# Altium project PE2.PrjPcb
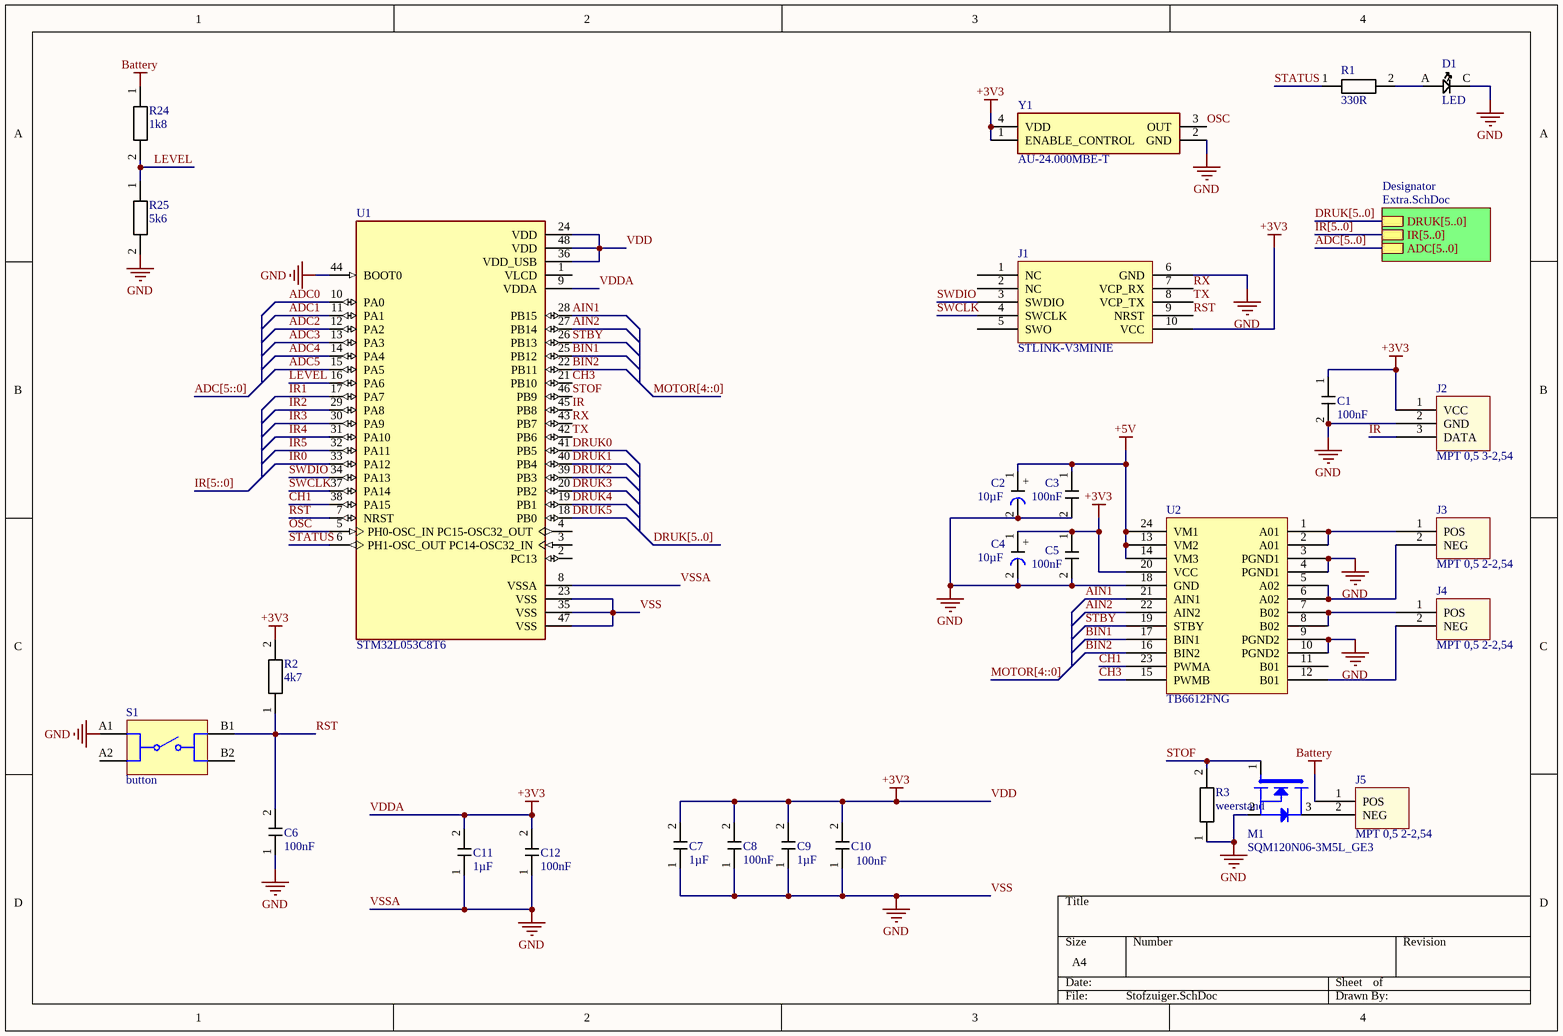
[diagram p0: Stofzuiger.SchDoc]
2 sheets, 76 parts. Net scope: hierarchical (ports join the sheet entries above them; power ports are global).
Board file: Stofzuiger.PcbDoc
Sheets:
  Stofzuiger.SchDoc
    Designator = Extra.SchDoc

## Sheet Stofzuiger.SchDoc
size A4; SheetNumber: 1; SheetTotal: 2

### Parts
C1  100nF  [0603]
C2  10µF  [0603]
C3  100nF  [0603]
C4  10µF  [0603]
C5  100nF  [0603]
C6  100nF  [0603]
C7  1µF  [0603]
C8  100nF  [0603]
C9  1µF  [0603]
C10  100nF  [0603]
C11  1µF  [0603]
C12  100nF  [0603]
D1  LED  [LED]
J1  STLINK-V3MINIE  [STLINK-V3MINIE]
J2  MPT 0,5 3-2,54  [MPT 0,5 3-2,54]
J3  MPT 0,5 2-2,54  [MPT 0,5 2-2,54]
J4  MPT 0,5 2-2,54  [MPT 0,5 2-2,54]
J5  MPT 0,5 2-2,54  [MPT 0,5 2-2,54]
M1  SQM120N06-3M5L_GE3  [IPB022N12NM6]
R1  330R  [0603]
R2  4k7  [0603]
R3  weerstand  [0603]
R24  1k8  [0603]
R25  5k6  [0603]
S1  button  [BUTTON]
U1  STM32L053C8T6  [stm32l053c8t6]
U2  TB6612FNG  [TB6612FNG]
Y1  AU-24.000MBE-T  [AU-24.000MBE-T]

### Sub-sheets
Designator = Extra.SchDoc: IR[5..0], ADC[5..0], DRUK[5..0]

### Nets
+5V: C2.1(+) C3.1(G) U2.13(VM2) U2.14(VM3) U2.24(VM1)
Battery: J5.1(POS) R24.1
VDD: C1.1(G) C4.1(+) C5.1(G) C7.2(G) C8.2(G) C9.2(G) C10.2(G) C11.2(G) C12.2(G) J1.10(VCC) J2.1(VCC) R2.2(G) U1.9(VDDA) U1.24(VDD) U1.36(VDD_USB) U1.48(VDD) U2.20(VCC) Y1.1(ENABLE_CONTROL) Y1.4(VDD)  [also labelled +3V3, VDDA]
VSS: C1.2(G) C2.2(G) C3.2(G) C4.2(G) C5.2(G) C6.1(G) C7.1(G) C8.1(G) C9.1(G) C10.1(G) C11.1(G) C12.1(G) D1.C J1.6(GND) J2.2(GND) M1.2(S) R3.1 R25.2(G) S1.A1 U1.8(VSSA) U1.23(VSS) U1.35(VSS) U1.44(BOOT0) U1.47(VSS) U2.3(PGND1) U2.4(PGND1) U2.9(PGND2) U2.10(PGND2) U2.18(GND) Y1.2(GND)  [also labelled GND, VSSA]
ADC0: U1.10(PA0)
ADC1: U1.11(PA1)
ADC2: U1.12(PA2)
ADC3: U1.13(PA3)
ADC4: U1.14(PA4)
ADC5: U1.15(PA5)
AIN1: U1.28(PB15) U2.21(AIN1)
AIN2: U1.27(PB14) U2.22(AIN2)
BIN1: U1.25(PB12) U2.17(BIN1)
BIN2: U1.22(PB11) U2.16(BIN2)
CH1: U1.38(PA15) U2.23(PWMA)
CH3: U1.21(PB10) U2.15(PWMB)
DRUK0: U1.41(PB5)
DRUK1: U1.40(PB4)
DRUK2: U1.39(PB3)
DRUK3: U1.20(PB2)
DRUK4: U1.19(PB1)
DRUK5: U1.18(PB0)
IR: J2.3(DATA) U1.45(PB8)
IR0: U1.33(PA12)
IR1: U1.17(PA7)
IR2: U1.29(PA8)
IR3: U1.30(PA9)
IR4: U1.31(PA10)
IR5: U1.32(PA11)
LEVEL: R24.2(G) R25.1 U1.16(PA6)
OSC: U1.5(PH0-OSC_IN) Y1.3(OUT)
RST: C6.2(G) J1.9(NRST) R2.1 S1.B1 U1.7(NRST)
RX: J1.7(VCP_RX) U1.43(PB7)
STATUS: R1.1 U1.6(PH1-OSC_OUT)
STBY: U1.26(PB13) U2.19(STBY)
STOF: M1.1(G) R3.2(G) U1.46(PB9)
SWCLK: J1.4(SWCLK) U1.37(PA14)
SWDIO: J1.3(SWDIO) U1.34(PA13)
TX: J1.8(VCP_TX) U1.42(PB6)
NetD1_A: D1.A R1.2(G)
NetJ3_1: J3.1(POS) U2.1(A01) U2.2(A01)
NetJ3_2: J3.2(NEG) U2.5(A02) U2.6(A02)
NetJ4_1: J4.1(POS) U2.7(B02) U2.8(B02)
NetJ4_2: J4.2(NEG) U2.12(B01)
NetJ5_2: J5.2(NEG) M1.3(D)

Not connected (* = marked no-connect by the designer): J1 1(NC) 2(NC) 5(SWO); S1 A2 B2; U1 1(VLCD) 2(PC13) 3(PC14-OSC32_IN) 4(PC15-OSC32_OUT); U2 11(B01)

### Buses and harness runs
bus ADC[5..0] = sheet Designator/ADC[5..0]
bus ADC[5::0]
bus DRUK[5..0]
bus DRUK[5..0] = sheet Designator/DRUK[5..0]
bus IR[5..0] = sheet Designator/IR[5..0]
bus IR[5::0]
bus MOTOR[4::0]

### Library data of the parts
C1 C3 C5 C11 C12 = cap
C2 C4 = elco
C6-C10 = Condensator
M1 = IPB022N12NM6
R1 R2 R24 R25 = weerstand

## Sheet Extra.SchDoc
size A4; SheetNumber: 2; SheetTotal: 2
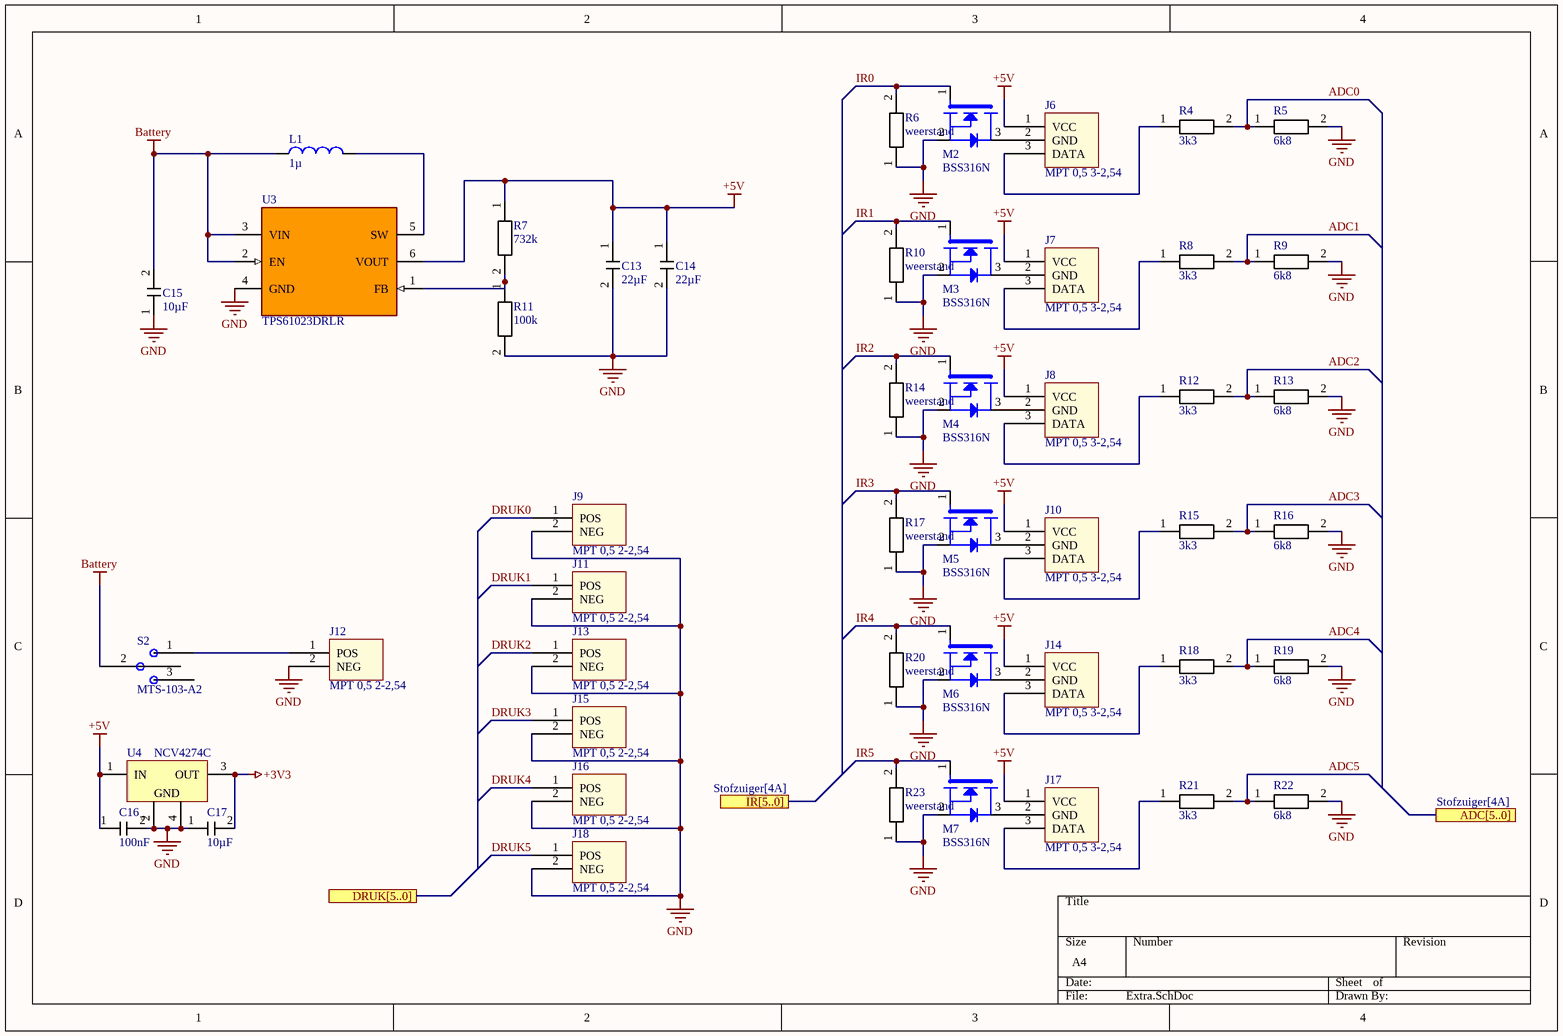
[diagram p1: Extra.SchDoc]

### Parts
C13  22µF  [0603]
C14  22µF  [0603]
C15  10µF  [0603]
C16  100nF  [0603]
C17  10µF  [0603]
J6  MPT 0,5 3-2,54  [MPT 0,5 3-2,54]
J7  MPT 0,5 3-2,54  [MPT 0,5 3-2,54]
J8  MPT 0,5 3-2,54  [MPT 0,5 3-2,54]
J9  MPT 0,5 2-2,54  [MPT 0,5 2-2,54]
J10  MPT 0,5 3-2,54  [MPT 0,5 3-2,54]
J11  MPT 0,5 2-2,54  [MPT 0,5 2-2,54]
J12  MPT 0,5 2-2,54  [MPT 0,5 2-2,54]
J13  MPT 0,5 2-2,54  [MPT 0,5 2-2,54]
J14  MPT 0,5 3-2,54  [MPT 0,5 3-2,54]
J15  MPT 0,5 2-2,54  [MPT 0,5 2-2,54]
J16  MPT 0,5 2-2,54  [MPT 0,5 2-2,54]
J17  MPT 0,5 3-2,54  [MPT 0,5 3-2,54]
J18  MPT 0,5 2-2,54  [MPT 0,5 2-2,54]
L1  1µ  [0603]
M2  BSS316N  [BSS316N]
M3  BSS316N  [BSS316N]
M4  BSS316N  [BSS316N]
M5  BSS316N  [BSS316N]
M6  BSS316N  [BSS316N]
M7  BSS316N  [BSS316N]
R4  3k3  [0603]
R5  6k8  [0603]
R6  weerstand  [0603]
R7  732k  [0603]
R8  3k3  [0603]
R9  6k8  [0603]
R10  weerstand  [0603]
R11  100k  [0603]
R12  3k3  [0603]
R13  6k8  [0603]
R14  weerstand  [0603]
R15  3k3  [0603]
R16  6k8  [0603]
R17  weerstand  [0603]
R18  3k3  [0603]
R19  6k8  [0603]
R20  weerstand  [0603]
R21  3k3  [0603]
R22  6k8  [0603]
R23  weerstand  [0603]
S2  MTS-103-A2  [MTS-103-A2]
U3  TPS61023DRLR  [TPS61023DRLR]
U4  NCV4274C  [NCV4274C]

### Ports
ADC[5..0] (see Stofzuiger[4A]), DRUK[5..0] (see Stofzuiger[4A]), IR[5..0] (see Stofzuiger[4A])

### Nets
+3V3: C17.2(G) U4.3(OUT)  [project net VDD]
+5V: C13.1(G) C14.1(G) C16.1(G) J6.1(VCC) J7.1(VCC) J8.1(VCC) J10.1(VCC) J14.1(VCC) J17.1(VCC) R7.1 U3.6(VOUT) U4.1(IN)
Battery: C15.2(G) L1.1 S2.2 U3.2(EN) U3.3(VIN)
GND: C13.2(G) C14.2(G) C15.1(G) C16.2(G) C17.1(G) J9.2(NEG) J11.2(NEG) J12.2(NEG) J13.2(NEG) J15.2(NEG) J16.2(NEG) J18.2(NEG) M2.2(S) M3.2(S) M4.2(S) M5.2(S) M6.2(S) M7.2(S) R5.2(G) R6.1 R9.2(G) R10.1 R11.2(G) R13.2(G) R14.1 R16.2(G) R17.1 R19.2(G) R20.1 R22.2(G) R23.1 U3.4(GND) U4.2(GND) U4.4(GND)  [project net VSS]
ADC0: R4.2(G) R5.1
ADC1: R8.2(G) R9.1
ADC2: R12.2(G) R13.1
ADC3: R15.2(G) R16.1
ADC4: R18.2(G) R19.1
ADC5: R21.2(G) R22.1
DRUK0: J9.1(POS)
DRUK1: J11.1(POS)
DRUK2: J13.1(POS)
DRUK3: J15.1(POS)
DRUK4: J16.1(POS)
DRUK5: J18.1(POS)
IR0: M2.1(G) R6.2(G)
IR1: M3.1(G) R10.2(G)
IR2: M4.1(G) R14.2(G)
IR3: M5.1(G) R17.2(G)
IR4: M6.1(G) R20.2(G)
IR5: M7.1(G) R23.2(G)
NetJ6_2: J6.2(GND) M2.3(D)
NetJ6_3: J6.3(DATA) R4.1
NetJ7_2: J7.2(GND) M3.3(D)
NetJ7_3: J7.3(DATA) R8.1
NetJ8_2: J8.2(GND) M4.3(D)
NetJ8_3: J8.3(DATA) R12.1
NetJ10_2: J10.2(GND) M5.3(D)
NetJ10_3: J10.3(DATA) R15.1
NetJ12_1: J12.1(POS) S2.1
NetJ14_2: J14.2(GND) M6.3(D)
NetJ14_3: J14.3(DATA) R18.1
NetJ17_2: J17.2(GND) M7.3(D)
NetJ17_3: J17.3(DATA) R21.1
NetL1_2: L1.2 U3.5(SW)
NetR7_2: R7.2(G) R11.1 U3.1(FB)

Not connected (* = marked no-connect by the designer): S2 3

### Library data of the parts
C13-C17 = cap
L1 = spoel
R4 R5 R7-R9 R11-R13 R15 R16 R18 R19 R21 R22 = weerstand

## Nets that join several sheets
+5V: Stofzuiger (5 pins), Extra (12 pins)
Battery: Stofzuiger (J5.1 R24.1), Extra (5 pins)
VDD: Stofzuiger (19 pins), Extra (C17.2 U4.3)
VSS: Stofzuiger (30 pins), Extra (34 pins)